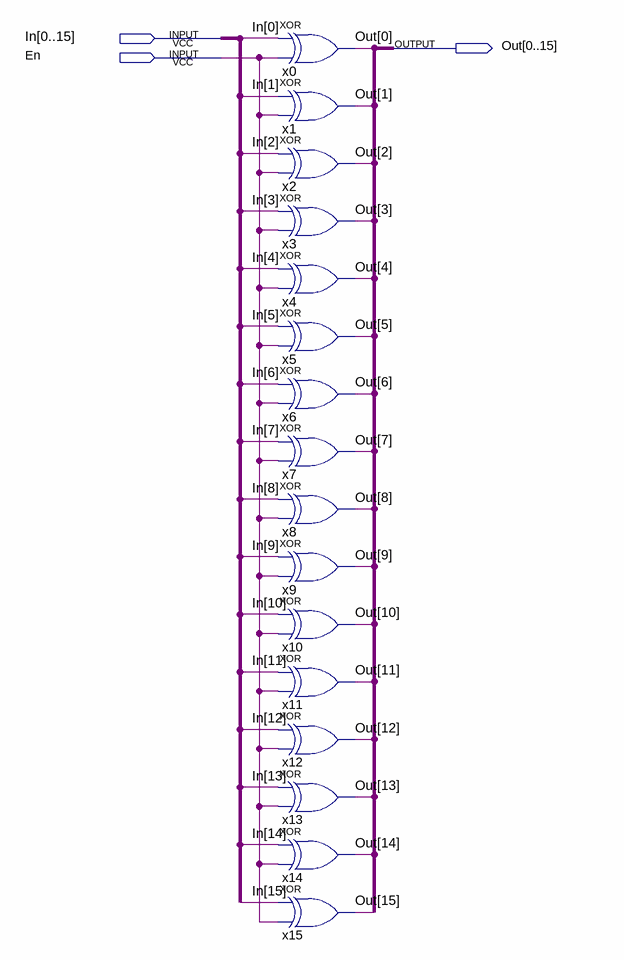
[diagram p0: schematic sheet]
// Quartus schematic complement16.bdf as structural Verilog: 16 symbols, 3 pins
module complement16 (
  input  [0:15] In,
  input  En,
  output [0:15] Out
);

  xor x0 (Out[0], In[0], En);
  xor x1 (Out[1], In[1], En);
  xor x2 (Out[2], In[2], En);
  xor x3 (Out[3], In[3], En);
  xor x4 (Out[4], In[4], En);
  xor x5 (Out[5], In[5], En);
  xor x6 (Out[6], In[6], En);
  xor x7 (Out[7], In[7], En);
  xor x8 (Out[8], In[8], En);
  xor x9 (Out[9], In[9], En);
  xor x10 (Out[10], In[10], En);
  xor x11 (Out[11], In[11], En);
  xor x12 (Out[12], In[12], En);
  xor x13 (Out[13], In[13], En);
  xor x14 (Out[14], In[14], En);
  xor x15 (Out[15], In[15], En);
endmodule
